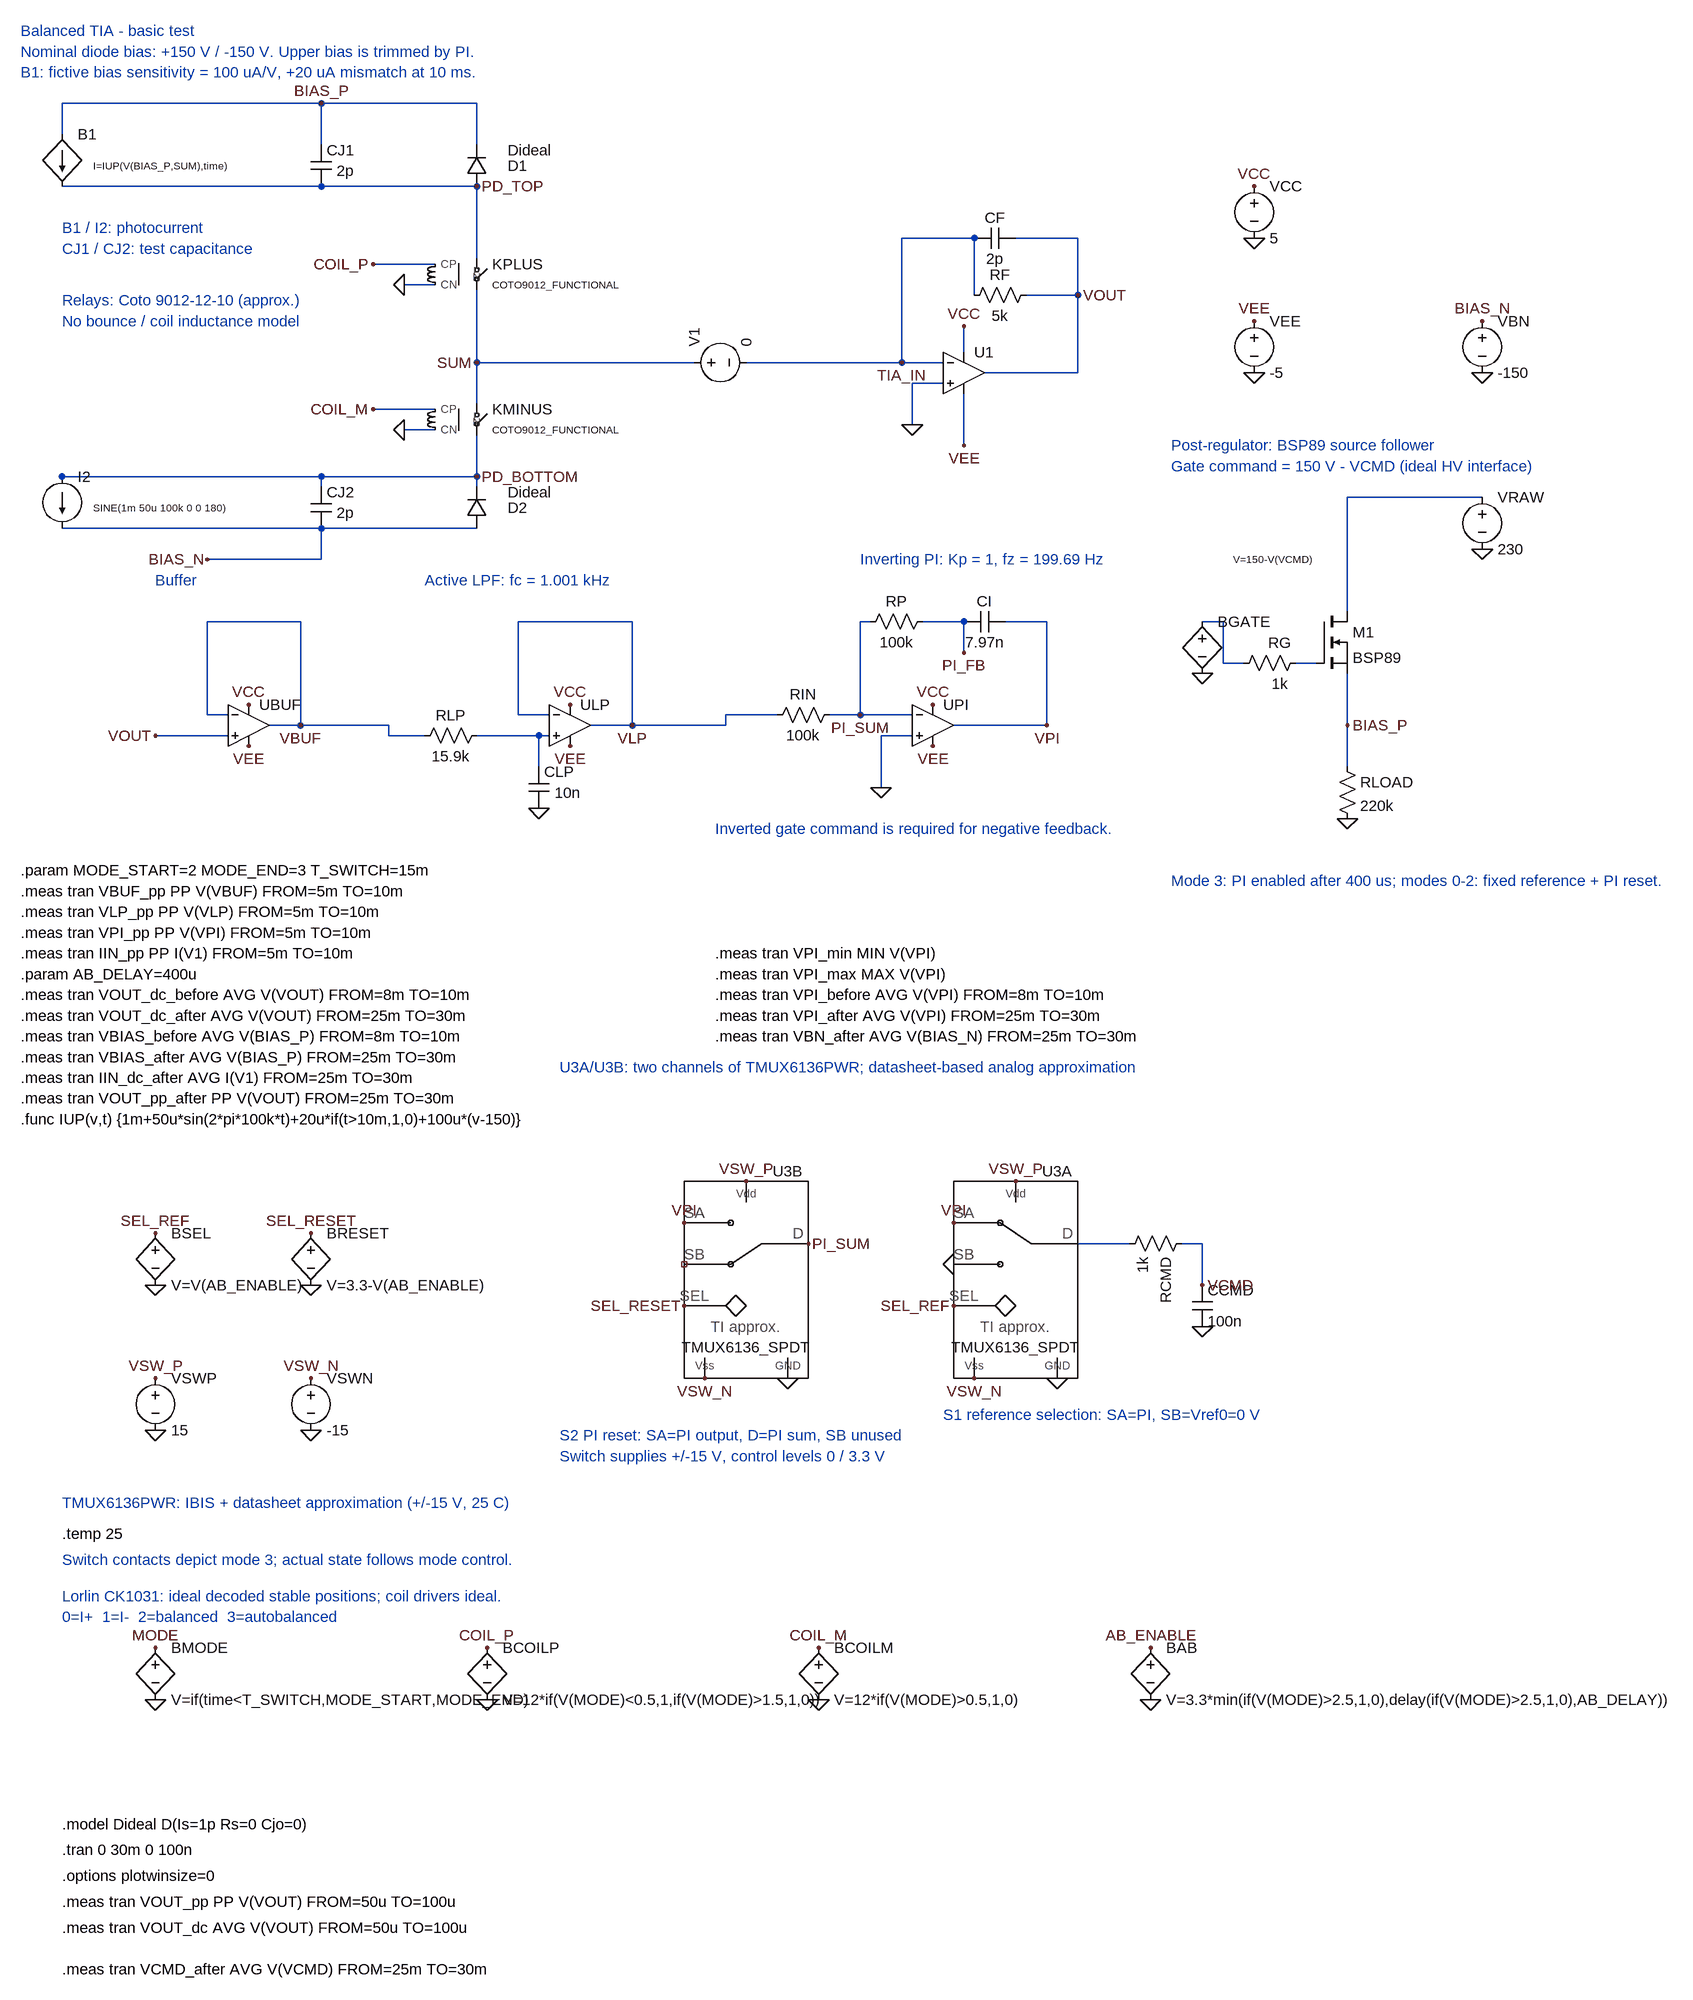
[diagram p0: schematic tia_check.asc]
tia_check.asc, the LTspice schematic file:
Version 4
SHEET 1 2480 2264
WIRE 2288 768 2080 768
WIRE 2080 944 2080 768
WIRE 464 960 320 960
WIRE 976 960 800 960
WIRE 1344 960 1328 960
WIRE 1488 960 1424 960
WIRE 1616 960 1552 960
WIRE 1888 960 1856 960
WIRE 1488 1008 1488 960
WIRE 1888 1024 1888 960
WIRE 1920 1024 1888 1024
WIRE 2032 1024 2000 1024
WIRE 320 1104 320 960
WIRE 352 1104 320 1104
WIRE 800 1104 800 960
WIRE 848 1104 800 1104
WIRE 1200 1104 1120 1104
WIRE 1328 1104 1328 960
WIRE 1328 1104 1280 1104
WIRE 1408 1104 1328 1104
WIRE 464 1120 464 960
WIRE 464 1120 416 1120
WIRE 600 1120 464 1120
WIRE 976 1120 976 960
WIRE 976 1120 912 1120
WIRE 1120 1120 1120 1104
WIRE 1120 1120 976 1120
WIRE 1616 1120 1616 960
WIRE 1616 1120 1472 1120
WIRE 2080 1120 2080 1040
WIRE 352 1136 240 1136
WIRE 600 1136 600 1120
WIRE 656 1136 600 1136
WIRE 832 1136 736 1136
WIRE 848 1136 832 1136
WIRE 1408 1136 1360 1136
WIRE 832 1184 832 1136
WIRE 2080 1184 2080 1120
WIRE 1360 1216 1360 1136
WIRE 1744 1920 1664 1920
WIRE 1856 1920 1824 1920
WIRE 1856 1984 1856 1920
WIRE 96 208 96 160
WIRE 96 160 496 160
WIRE 496 224 496 160
WIRE 736 224 736 160
WIRE 736 160 496 160
WIRE 96 288 496 288
WIRE 496 288 736 288
WIRE 736 288 736 400
WIRE 736 448 736 560
WIRE 736 624 736 560
WIRE 736 560 1072 560
WIRE 736 672 736 736
WIRE 96 736 736 736
WIRE 496 752 496 736
WIRE 496 736 96 736
WIRE 736 752 736 736
WIRE 96 816 496 816
WIRE 496 816 736 816
WIRE 496 816 496 864
WIRE 496 864 320 864
WIRE 672 408 576 408
WIRE 672 632 576 632
WIRE 1152 560 1392 560
WIRE 1456 560 1392 560
WIRE 1504 368 1392 368
WIRE 1392 368 1392 560
WIRE 1504 456 1504 368
WIRE 1568 368 1664 368
WIRE 1664 368 1664 456
WIRE 1584 456 1664 456
WIRE 1520 576 1664 576
WIRE 1664 576 1664 456
WIRE 1488 544 1488 504
WIRE 1488 608 1488 688
WIRE 672 440 624 440
WIRE 672 664 624 664
WIRE 1456 592 1408 592
WIRE 1408 592 1408 656
FLAG 496 160 BIAS_P
FLAG 736 288 PD_TOP
FLAG 736 560 SUM
FLAG 736 736 PD_BOTTOM
FLAG 320 864 BIAS_N
FLAG 1392 560 TIA_IN
FLAG 1664 456 VOUT
FLAG 1488 504 VCC
FLAG 1488 688 VEE
FLAG 576 408 COIL_P
FLAG 576 632 COIL_M
FLAG 240 1136 VOUT
FLAG 464 1120 VBUF
FLAG 976 1120 VLP
FLAG 1488 1008 PI_FB
FLAG 1616 1120 VPI
FLAG 384 1088 VCC
FLAG 384 1152 VEE
FLAG 880 1088 VCC
FLAG 880 1152 VEE
FLAG 1440 1088 VCC
FLAG 1440 1152 VEE
FLAG 832 1248 0
FLAG 1360 1216 0
FLAG 2080 1120 BIAS_P
FLAG 1856 1040 0
FLAG 2288 848 0
FLAG 2080 1264 0
FLAG 1568 1824 VSW_P
FLAG 1504 2128 VSW_N
FLAG 1632 2128 0
FLAG 1472 1888 VPI
FLAG 1152 1824 VSW_P
FLAG 1088 2128 VSW_N
FLAG 1216 2128 0
FLAG 1056 1888 VPI
FLAG 1472 1952 0
FLAG 1472 2016 SEL_REF
FLAG 1056 2016 SEL_RESET
FLAG 1328 1104 PI_SUM
FLAG 1248 1920 PI_SUM
FLAG 240 1904 SEL_REF
FLAG 480 1904 SEL_RESET
FLAG 240 2128 VSW_P
FLAG 480 2128 VSW_N
FLAG 240 1984 0
FLAG 480 1984 0
FLAG 240 2208 0
FLAG 480 2208 0
FLAG 1856 1984 VCMD
FLAG 1856 2048 0
FLAG 240 2544 MODE
FLAG 240 2624 0
FLAG 752 2544 COIL_P
FLAG 752 2624 0
FLAG 1264 2544 COIL_M
FLAG 1264 2624 0
FLAG 1776 2544 AB_ENABLE
FLAG 1776 2624 0
FLAG 624 440 0
FLAG 624 664 0
FLAG 1408 656 0
FLAG 1936 288 VCC
FLAG 1936 368 0
FLAG 1936 496 VEE
FLAG 1936 576 0
FLAG 2288 496 BIAS_N
FLAG 2288 576 0
SYMBOL bi 96 208 R0
WINDOW 3 48 48 Left 1
SYMATTR InstName B1
SYMATTR Value I=IUP(V(BIAS_P,SUM),time)
SYMBOL cap 480 224 R0
WINDOW 3 40 40 Left 2
SYMATTR InstName CJ1
SYMATTR Value 2p
SYMBOL diode 752 288 R180
WINDOW 0 -32 32 Right 2
WINDOW 3 -32 56 Right 2
SYMATTR InstName D1
SYMATTR Value Dideal
SYMBOL current 96 736 R0
WINDOW 3 48 48 Left 1
SYMATTR InstName I2
SYMATTR Value SINE(1m 50u 100k 0 0 180)
SYMBOL cap 480 752 R0
WINDOW 3 40 40 Left 2
SYMATTR InstName CJ2
SYMATTR Value 2p
SYMBOL diode 752 816 R180
WINDOW 0 -32 32 Right 2
WINDOW 3 -32 56 Right 2
SYMATTR InstName D2
SYMATTR Value Dideal
SYMBOL OpAmps/UniversalOpamp2 1488 576 R0
SYMATTR InstName U1
SYMATTR Value2 Avol=100k GBW=50Meg Slew=200Meg
SYMBOL res 1600 440 R90
WINDOW 0 0 56 VBottom 2
WINDOW 3 32 56 VTop 2
SYMATTR InstName RF
SYMATTR Value 5k
SYMBOL cap 1568 352 R90
WINDOW 0 0 32 VBottom 2
WINDOW 3 32 32 VTop 2
SYMATTR InstName CF
SYMATTR Value 2p
SYMBOL voltage 1936 272 R0
SYMATTR InstName VCC
SYMATTR Value 5
SYMBOL voltage 1936 480 R0
SYMATTR InstName VEE
SYMATTR Value -5
SYMBOL voltage 2288 480 R0
SYMATTR InstName VBN
SYMATTR Value -150
SYMBOL voltage 1056 560 R270
SYMATTR InstName V1
SYMATTR Value 0
SYMBOL OpAmps/UniversalOpamp2 384 1120 R0
SYMATTR InstName UBUF
SYMATTR Value2 Avol=100k GBW=50Meg Slew=200Meg
SYMBOL res 752 1120 R90
WINDOW 0 0 56 VBottom 2
WINDOW 3 32 56 VTop 2
SYMATTR InstName RLP
SYMATTR Value 15.9k
SYMBOL cap 816 1184 R0
WINDOW 3 40 40 Left 2
SYMATTR InstName CLP
SYMATTR Value 10n
SYMBOL OpAmps/UniversalOpamp2 880 1120 R0
SYMATTR InstName ULP
SYMATTR Value2 Avol=100k GBW=50Meg Slew=200Meg
SYMBOL res 1296 1088 R90
WINDOW 0 0 56 VBottom 2
WINDOW 3 32 56 VTop 2
SYMATTR InstName RIN
SYMATTR Value 100k
SYMBOL res 1440 944 R90
WINDOW 0 0 56 VBottom 2
WINDOW 3 32 56 VTop 2
SYMATTR InstName RP
SYMATTR Value 100k
SYMBOL cap 1552 944 R90
WINDOW 0 0 32 VBottom 2
WINDOW 3 32 32 VTop 2
SYMATTR InstName CI
SYMATTR Value 7.97n
SYMBOL OpAmps/UniversalOpamp2 1440 1120 R0
SYMATTR InstName UPI
SYMATTR Value2 Avol=100k GBW=50Meg Slew=200Meg
SYMBOL bv 1856 944 R0
WINDOW 3 48 -80 Left 1
SYMATTR InstName BGATE
SYMATTR Value V=150-V(VCMD)
SYMBOL res 2016 1008 R90
WINDOW 0 0 40 VBottom 2
WINDOW 3 32 40 VTop 2
SYMATTR InstName RG
SYMATTR Value 1k
SYMBOL nmos 2032 944 R0
SYMATTR InstName M1
SYMATTR Value BSP89
SYMBOL voltage 2288 752 R0
SYMATTR InstName VRAW
SYMATTR Value 230
SYMBOL res 2064 1168 R0
SYMATTR InstName RLOAD
SYMATTR Value 220k
SYMBOL res 1840 1904 R90
SYMATTR InstName RCMD
SYMATTR Value 1k
SYMBOL cap 1840 1984 R0
SYMATTR InstName CCMD
SYMATTR Value 100n
SYMBOL voltage 240 2112 R0
SYMATTR InstName VSWP
SYMATTR Value 15
SYMBOL voltage 480 2112 R0
SYMATTR InstName VSWN
SYMATTR Value -15
SYMBOL Switches/TMUX6136_SPDT 1568 1968 R0
SYMATTR InstName U3A
SYMBOL Switches/TMUX6136_SPDT_B 1152 1968 R0
SYMATTR InstName U3B
SYMBOL Switches/Coto9012_reed 736 400 R0
SYMATTR InstName KPLUS
SYMBOL Switches/Coto9012_reed 736 624 R0
SYMATTR InstName KMINUS
SYMBOL bv 240 1888 R0
SYMATTR InstName BSEL
SYMATTR Value V=V(AB_ENABLE)
SYMBOL bv 480 1888 R0
SYMATTR InstName BRESET
SYMATTR Value V=3.3-V(AB_ENABLE)
SYMBOL bv 240 2528 R0
SYMATTR InstName BMODE
SYMATTR Value V=if(time<T_SWITCH,MODE_START,MODE_END)
SYMBOL bv 752 2528 R0
SYMATTR InstName BCOILP
SYMATTR Value V=12*if(V(MODE)<0.5,1,if(V(MODE)>1.5,1,0))
SYMBOL bv 1264 2528 R0
SYMATTR InstName BCOILM
SYMATTR Value V=12*if(V(MODE)>0.5,1,0)
SYMBOL bv 1776 2528 R0
SYMATTR InstName BAB
SYMATTR Value V=3.3*min(if(V(MODE)>2.5,1,0),delay(if(V(MODE)>2.5,1,0),AB_DELAY))
TEXT 32 48 Left 2 ;Balanced TIA - basic test
TEXT 32 80 Left 2 ;Nominal diode bias: +150 V / -150 V. Upper bias is trimmed by PI.
TEXT 32 112 Left 2 ;B1: fictive bias sensitivity = 100 uA/V, +20 uA mismatch at 10 ms.
TEXT 240 896 Left 2 ;Buffer
TEXT 656 896 Left 2 ;Active LPF: fc = 1.001 kHz
TEXT 1328 864 Left 2 ;Inverting PI: Kp = 1, fz = 199.69 Hz
TEXT 1808 688 Left 2 ;Post-regulator: BSP89 source follower
TEXT 1104 1280 Left 2 ;Inverted gate command is required for negative feedback.
TEXT 32 1376 Left 2 !.meas tran VBUF_pp PP V(VBUF) FROM=5m TO=10m
TEXT 32 1408 Left 2 !.meas tran VLP_pp PP V(VLP) FROM=5m TO=10m
TEXT 32 1440 Left 2 !.meas tran VPI_pp PP V(VPI) FROM=5m TO=10m
TEXT 32 1472 Left 2 !.meas tran IIN_pp PP I(V1) FROM=5m TO=10m
TEXT 32 1536 Left 2 !.meas tran VOUT_dc_before AVG V(VOUT) FROM=8m TO=10m
TEXT 32 1568 Left 2 !.meas tran VOUT_dc_after AVG V(VOUT) FROM=25m TO=30m
TEXT 32 1600 Left 2 !.meas tran VBIAS_before AVG V(BIAS_P) FROM=8m TO=10m
TEXT 32 1632 Left 2 !.meas tran VBIAS_after AVG V(BIAS_P) FROM=25m TO=30m
TEXT 32 1664 Left 2 !.meas tran IIN_dc_after AVG I(V1) FROM=25m TO=30m
TEXT 32 1696 Left 2 !.meas tran VOUT_pp_after PP V(VOUT) FROM=25m TO=30m
TEXT 32 1728 Left 2 !.func IUP(v,t) {1m+50u*sin(2*pi*100k*t)+20u*if(t>10m,1,0)+100u*(v-150)}
TEXT 1104 1472 Left 2 !.meas tran VPI_min MIN V(VPI)
TEXT 1104 1504 Left 2 !.meas tran VPI_max MAX V(VPI)
TEXT 1104 1536 Left 2 !.meas tran VPI_before AVG V(VPI) FROM=8m TO=10m
TEXT 1104 1568 Left 2 !.meas tran VPI_after AVG V(VPI) FROM=25m TO=30m
TEXT 1104 1600 Left 2 !.meas tran VBN_after AVG V(BIAS_N) FROM=25m TO=30m
TEXT 1808 720 Left 2 ;Gate command = 150 V - VCMD (ideal HV interface)
TEXT 1456 2184 Left 2 ;S1 reference selection: SA=PI, SB=Vref0=0 V
TEXT 864 2216 Left 2 ;S2 PI reset: SA=PI output, D=PI sum, SB unused
TEXT 864 2248 Left 2 ;Switch supplies +/-15 V, control levels 0 / 3.3 V
TEXT 96 2320 Left 2 ;TMUX6136PWR: IBIS + datasheet approximation (+/-15 V, 25 C)
TEXT 96 2368 Left 2 !.temp 25
TEXT 32 1504 Left 2 !.param AB_DELAY=400u
TEXT 96 2464 Left 2 ;Lorlin CK1031: ideal decoded stable positions; coil drivers ideal.
TEXT 96 2496 Left 2 ;0=I+  1=I-  2=balanced  3=autobalanced
TEXT 1808 1360 Left 2 ;Mode 3: PI enabled after 400 us; modes 0-2: fixed reference + PI reset.
TEXT 32 1344 Left 2 !.param MODE_START=2 MODE_END=3 T_SWITCH=15m
TEXT 96 2816 Left 2 !.model Dideal D(Is=1p Rs=0 Cjo=0)
TEXT 96 2856 Left 2 !.tran 0 30m 0 100n
TEXT 96 2896 Left 2 !.options plotwinsize=0
TEXT 96 2936 Left 2 !.meas tran VOUT_pp PP V(VOUT) FROM=50u TO=100u
TEXT 96 2976 Left 2 !.meas tran VOUT_dc AVG V(VOUT) FROM=50u TO=100u
TEXT 96 2408 Left 2 ;Switch contacts depict mode 3; actual state follows mode control.
TEXT 96 352 Left 2 ;B1 / I2: photocurrent
TEXT 96 384 Left 2 ;CJ1 / CJ2: test capacitance
TEXT 96 464 Left 2 ;Relays: Coto 9012-12-10 (approx.)
TEXT 96 496 Left 2 ;No bounce / coil inductance model
TEXT 864 1648 Left 2 ;U3A/U3B: two channels of TMUX6136PWR; datasheet-based analog approximation
TEXT 96 3040 Left 2 !.meas tran VCMD_after AVG V(VCMD) FROM=25m TO=30m

The netlist it stands for:
* tia_check.asc
B1 BIAS_P PD_TOP I=IUP(V(BIAS_P,SUM),time)
CJ1 BIAS_P PD_TOP 2p
D1 PD_TOP BIAS_P Dideal
I2 PD_BOTTOM BIAS_N SINE(1m 50u 100k 0 0 180)
CJ2 PD_BOTTOM BIAS_N 2p
D2 BIAS_N PD_BOTTOM Dideal
XU1 0 TIA_IN VCC VEE VOUT level.2 Avol=100k GBW=50Meg Slew=200Meg ilimit=25m rail=0 Vos=0 phimargin=45 en=0 enk=0 in=0 ink=0 Rin=500Meg  ; pins IN+ IN- V+ V- OUT
RF VOUT TIA_IN 5k
CF VOUT TIA_IN 2p
VCC VCC 0 5
VEE VEE 0 -5
VBN BIAS_N 0 -150
V1 SUM TIA_IN 0
XUBUF VOUT VBUF VCC VEE VBUF level.2 Avol=100k GBW=50Meg Slew=200Meg ilimit=25m rail=0 Vos=0 phimargin=45 en=0 enk=0 in=0 ink=0 Rin=500Meg  ; pins IN+ IN- V+ V- OUT
RLP N004 VBUF 15.9k
CLP N004 0 10n
XULP N004 VLP VCC VEE VLP level.2 Avol=100k GBW=50Meg Slew=200Meg ilimit=25m rail=0 Vos=0 phimargin=45 en=0 enk=0 in=0 ink=0 Rin=500Meg  ; pins IN+ IN- V+ V- OUT
RIN PI_SUM VLP 100k
RP PI_FB PI_SUM 100k
CI VPI PI_FB 7.97n
XUPI 0 PI_SUM VCC VEE VPI level.2 Avol=100k GBW=50Meg Slew=200Meg ilimit=25m rail=0 Vos=0 phimargin=45 en=0 enk=0 in=0 ink=0 Rin=500Meg  ; pins IN+ IN- V+ V- OUT
BGATE N002 0 V=150-V(VCMD)
RG N003 N002 1k
M1 N001 N003 BIAS_P BIAS_P BSP89
VRAW N001 0 230
RLOAD BIAS_P 0 220k
RCMD VCMD N005 1k
CCMD VCMD 0 100n
VSWP VSW_P 0 15
VSWN VSW_N 0 -15
XU3A SEL_REF VPI N005 0 VSW_N 0 VSW_P TMUX6136_SPDT  ; pins IN SA D SB Vss GND Vdd
XU3B SEL_RESET VPI PI_SUM NC_01 VSW_N 0 VSW_P TMUX6136_SPDT  ; pins IN SA D SB Vss GND Vdd
XKPLUS PD_TOP SUM COIL_P 0 COTO9012_FUNCTIONAL  ; pins P N CP CN
XKMINUS SUM PD_BOTTOM COIL_M 0 COTO9012_FUNCTIONAL  ; pins P N CP CN
BSEL SEL_REF 0 V=V(AB_ENABLE)
BRESET SEL_RESET 0 V=3.3-V(AB_ENABLE)
BMODE MODE 0 V=if(time<T_SWITCH,MODE_START,MODE_END)
BCOILP COIL_P 0 V=12*if(V(MODE)<0.5,1,if(V(MODE)>1.5,1,0))
BCOILM COIL_M 0 V=12*if(V(MODE)>0.5,1,0)
BAB AB_ENABLE 0 V=3.3*min(if(V(MODE)>2.5,1,0),delay(if(V(MODE)>2.5,1,0),AB_DELAY))
.model D D
.lib standard.dio
.model NMOS NMOS
.model PMOS PMOS
.lib standard.mos
* Balanced TIA - basic test
* Nominal diode bias: +150 V / -150 V. Upper bias is trimmed by PI.
* B1: fictive bias sensitivity = 100 uA/V, +20 uA mismatch at 10 ms.
* Buffer
* Active LPF: fc = 1.001 kHz
* Inverting PI: Kp = 1, fz = 199.69 Hz
* Post-regulator: BSP89 source follower
* Inverted gate command is required for negative feedback.
.meas tran VBUF_pp PP V(VBUF) FROM=5m TO=10m
.meas tran VLP_pp PP V(VLP) FROM=5m TO=10m
.meas tran VPI_pp PP V(VPI) FROM=5m TO=10m
.meas tran IIN_pp PP I(V1) FROM=5m TO=10m
.meas tran VOUT_dc_before AVG V(VOUT) FROM=8m TO=10m
.meas tran VOUT_dc_after AVG V(VOUT) FROM=25m TO=30m
.meas tran VBIAS_before AVG V(BIAS_P) FROM=8m TO=10m
.meas tran VBIAS_after AVG V(BIAS_P) FROM=25m TO=30m
.meas tran IIN_dc_after AVG I(V1) FROM=25m TO=30m
.meas tran VOUT_pp_after PP V(VOUT) FROM=25m TO=30m
.func IUP(v,t) {1m+50u*sin(2*pi*100k*t)+20u*if(t>10m,1,0)+100u*(v-150)}
.meas tran VPI_min MIN V(VPI)
.meas tran VPI_max MAX V(VPI)
.meas tran VPI_before AVG V(VPI) FROM=8m TO=10m
.meas tran VPI_after AVG V(VPI) FROM=25m TO=30m
.meas tran VBN_after AVG V(BIAS_N) FROM=25m TO=30m
* Gate command = 150 V - VCMD (ideal HV interface)
* S1 reference selection: SA=PI, SB=Vref0=0 V
* S2 PI reset: SA=PI output, D=PI sum, SB unused
* Switch supplies +/-15 V, control levels 0 / 3.3 V
* TMUX6136PWR: IBIS + datasheet approximation (+/-15 V, 25 C)
.temp 25
.param AB_DELAY=400u
* Lorlin CK1031: ideal decoded stable positions; coil drivers ideal.
* 0=I+  1=I-  2=balanced  3=autobalanced
* Mode 3: PI enabled after 400 us; modes 0-2: fixed reference + PI reset.
.param MODE_START=2 MODE_END=3 T_SWITCH=15m
.model Dideal D(Is=1p Rs=0 Cjo=0)
.tran 0 30m 0 100n
.options plotwinsize=0
.meas tran VOUT_pp PP V(VOUT) FROM=50u TO=100u
.meas tran VOUT_dc AVG V(VOUT) FROM=50u TO=100u
* Switch contacts depict mode 3; actual state follows mode control.
* B1 / I2: photocurrent
* CJ1 / CJ2: test capacitance
* Relays: Coto 9012-12-10 (approx.)
* No bounce / coil inductance model
* U3A/U3B: two channels of TMUX6136PWR; datasheet-based analog approximation
.meas tran VCMD_after AVG V(VCMD) FROM=25m TO=30m
.lib UniversalOpamps2.sub
.lib TMUX6136_extended.lib
.lib Coto9012_control.lib
.backanno
.end